# EasyEDA schematic LedGameboardLamp.json
TITLE: Sheet_1; REV: 1.0; Date: 2021-05-28; Sheet: 1/1; Drawn By: terra.gilbert; Company: Your Company
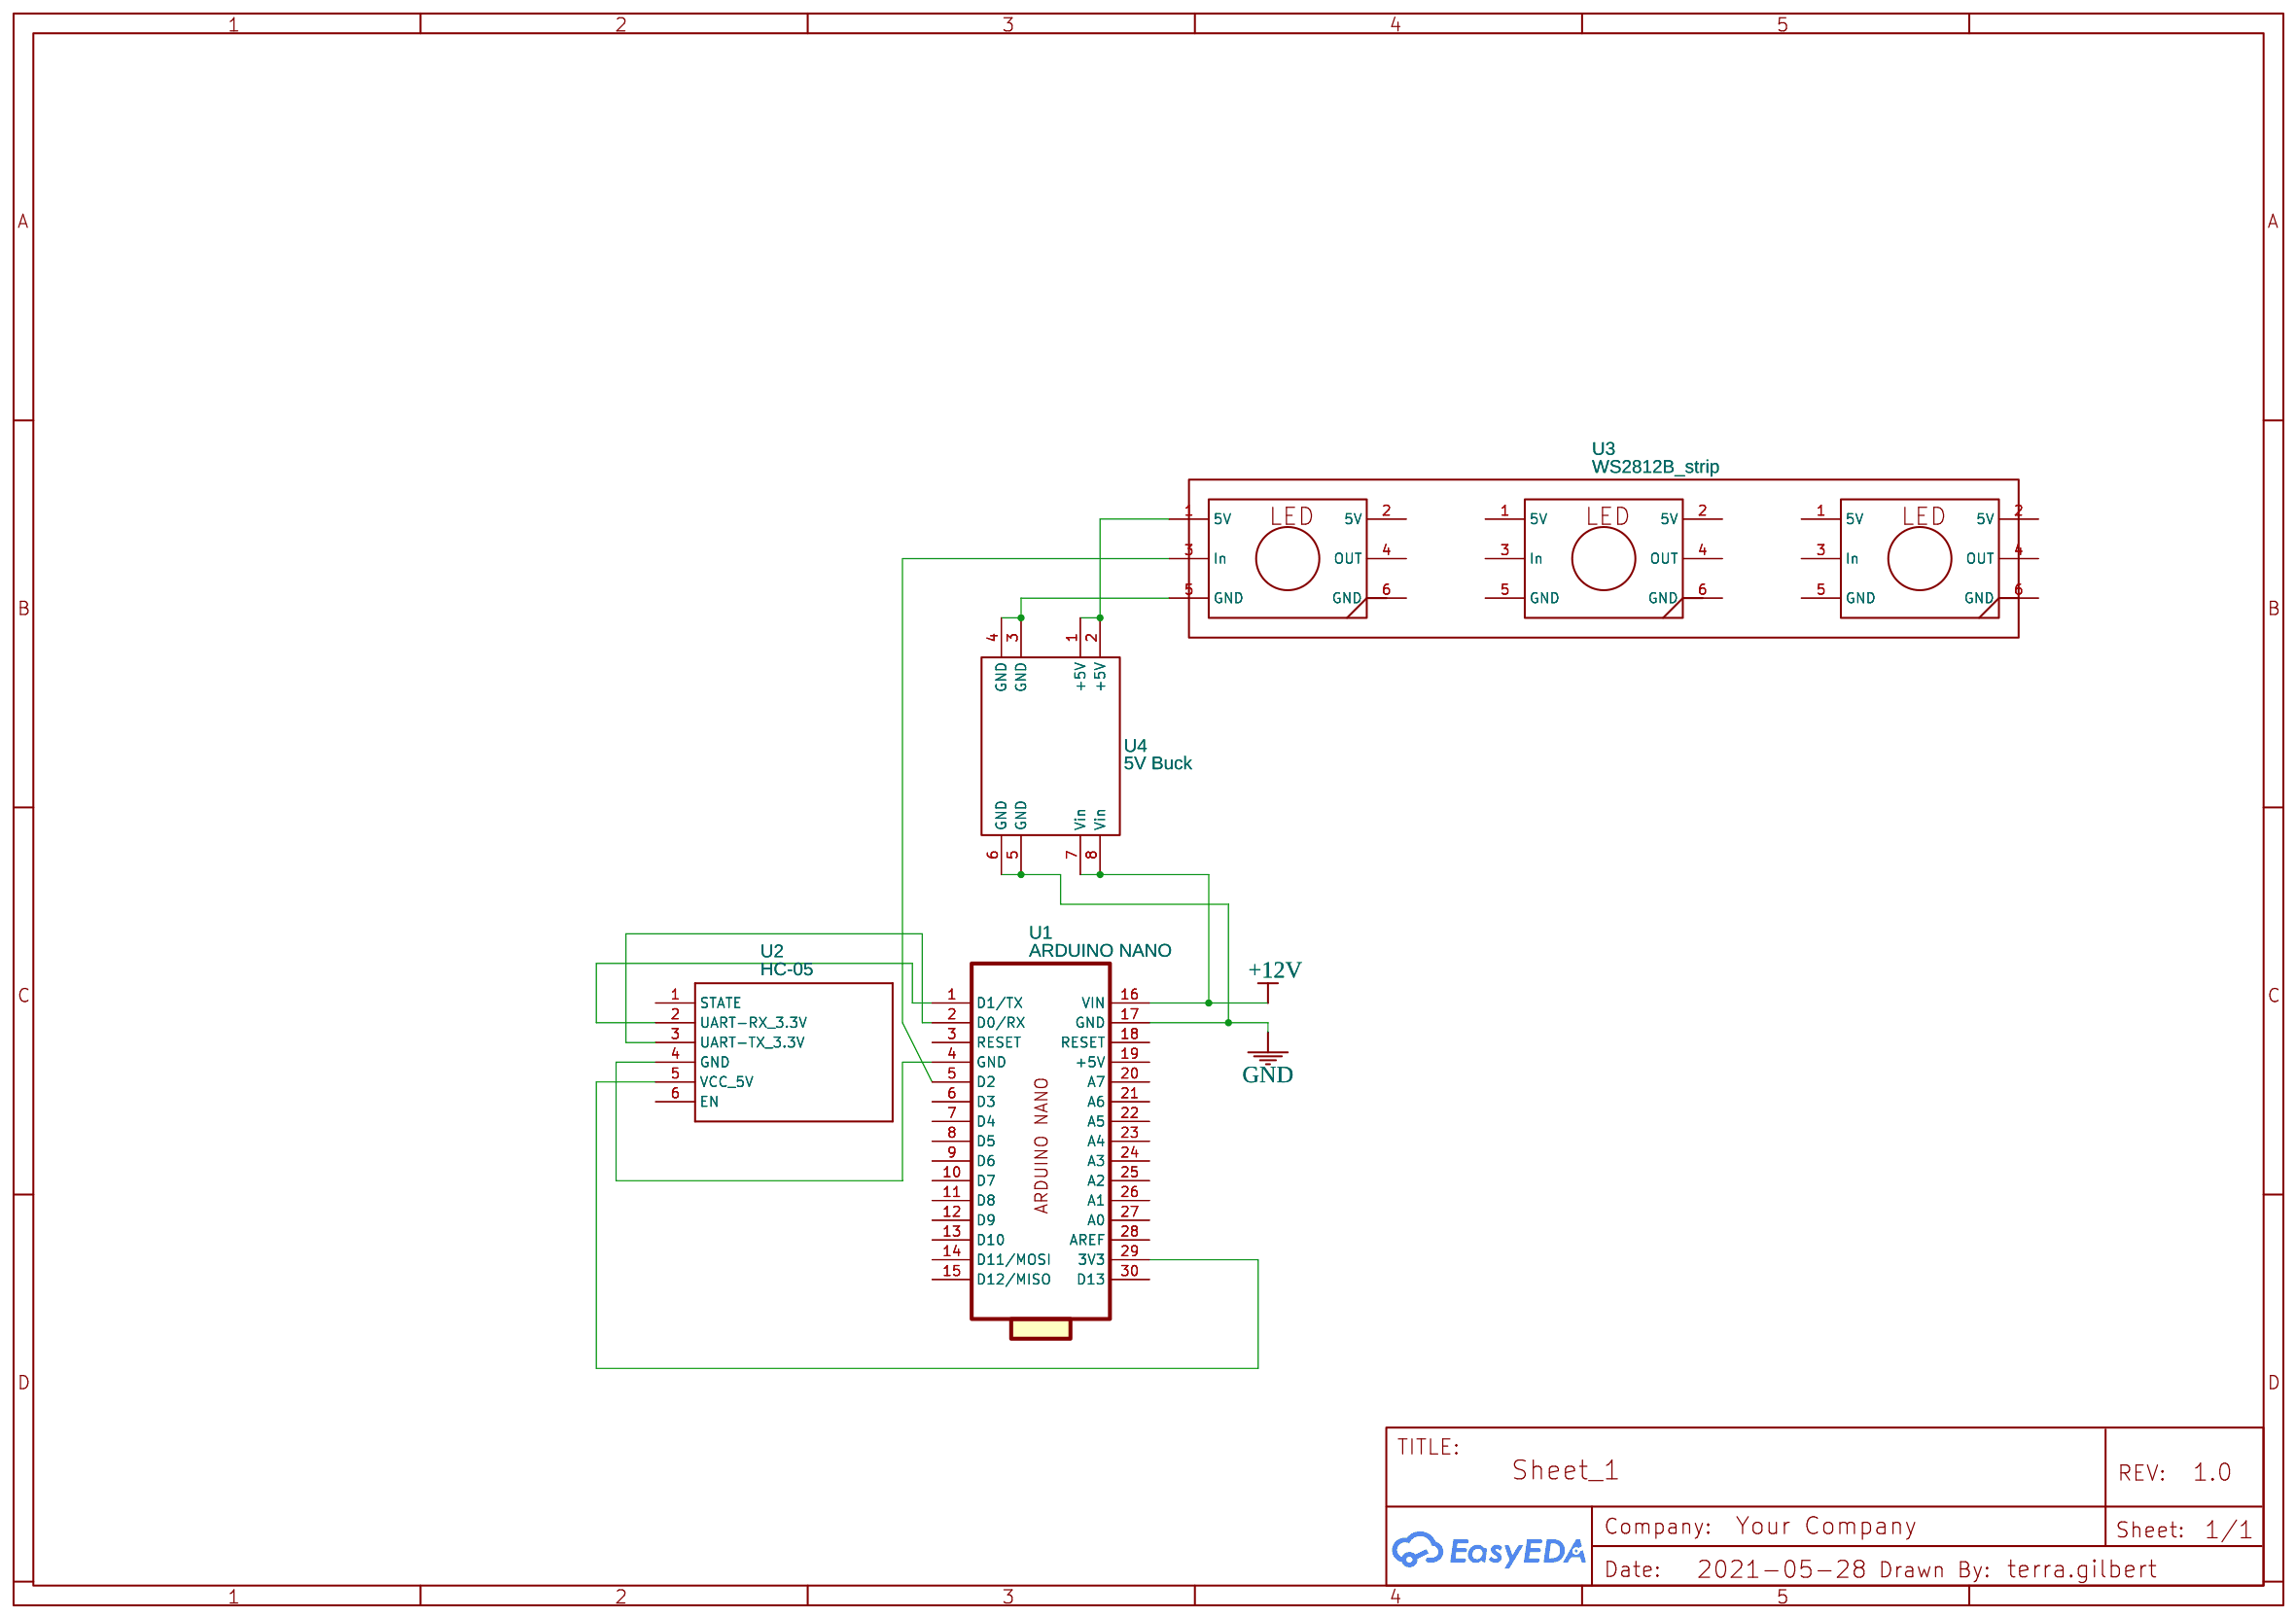
[diagram p0: schematic sheet]

## Parts
U1  ARDUINO NANO  [ARDUINO_NANO_REV1]
U2  HC-05  [ARDUINO-BLUETOOTH-HC-05]
U3  WS2812B_strip
U4  5V Buck  [5V BUCK]

## Library data of the parts
U1 = ARDUINO NANO: Manufacturer Part: arduino nano; Contributor: dams85
U2 = HC-05: SMD BT module; Bluetooth V2.0 Serial Transceiver Module - 3.3V; Supplier: Arduino
U3 = WS2812B_strip: Contributor: vpuchkov
U4 = 5V Buck: Contributor: gdave44

## Nets
+12V: U1.16(VIN) U4.7(Vin) U4.8(Vin)
GND: U1.17(GND) U4.5(GND) U4.6(GND)
Net-(U1-1): U1.1(D1/TX) U2.2(UART-RX 3.3V)
Net-(U1-2): U1.2(D0/RX) U2.3(UART-TX 3.3V)
Net-(U1-4): U1.4(GND) U2.4(GND)
Net-(U1-5): U1.5(D2) U3.3(In)
Net-(U1-29): U1.29(3V3) U2.5(VCC 5V)
Net-(U3-1): U3.1(5V) U4.1(+5V) U4.2(+5V)
Net-(U3-5): U3.5(GND) U4.3(GND) U4.4(GND)

Not connected (* = marked no-connect by the designer): U1 3(RESET) 6(D3) 7(D4) 8(D5) 9(D6) 10(D7) 11(D8) 12(D9) 13(D10) 14(D11/MOSI) 15(D12/MISO) 18(RESET) 19(+5V) 20(A7) 21(A6) 22(A5) 23(A4) 24(A3) 25(A2) 26(A1) 27(A0) 28(AREF) 30(D13); U2 1(STATE) 6(EN); U3 2(5V) 4(OUT) 6(GND)
